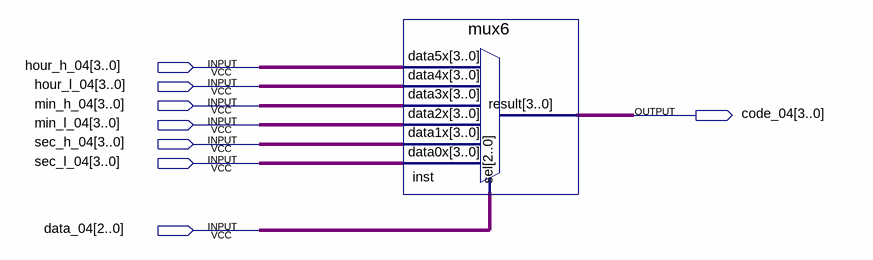
[diagram p0: schematic sheet]
// Quartus schematic code_select_04.bdf as structural Verilog: 1 symbols, 8 pins
module code_select_04 (
  input  [3:0] hour_h_04,
  input  [3:0] hour_l_04,
  input  [3:0] min_h_04,
  input  [3:0] min_l_04,
  input  [3:0] sec_h_04,
  input  [3:0] sec_l_04,
  input  [2:0] data_04,
  output [3:0] code_04
);

  mux6 inst (
    .data5x(hour_h_04), .data4x(hour_l_04), .data3x(min_h_04), .data2x(min_l_04), .data1x(sec_h_04),
    .data0x(sec_l_04), .sel(data_04), .result(code_04));
endmodule
